# Altium project MB1292.PrjPcb (part 1 of 3)
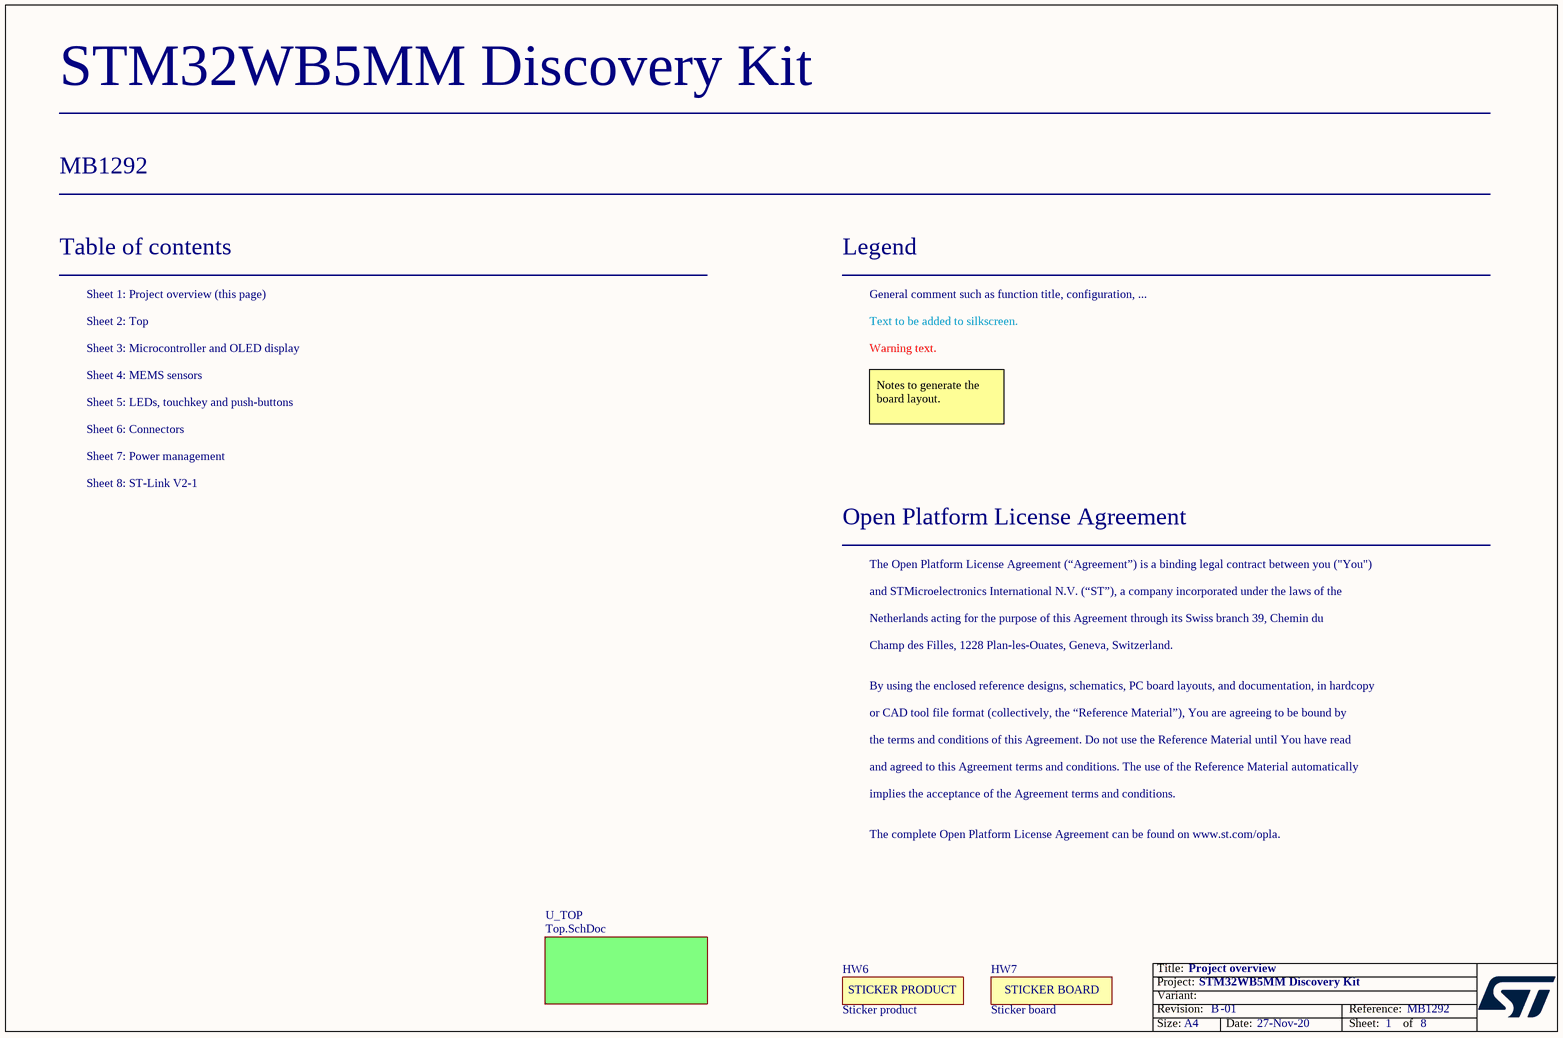
[diagram p0: Project_Overview.SchDoc]
Board_Assembly_Revision: 01; Board_Document_Date: 27-Nov-20; Board_Name: STM32WB5MM Discovery Kit; Board_PCB_Revision: B; Board_Reference: MB1292
8 sheets, 190 parts. Net scope: flat (ports and power ports of the same name join across sheets).
Board file: MB1292.PcbDoc
Sheets:
  Project_Overview.SchDoc
    U_TOP = Top.SchDoc
      U_ST-LINK_V2-1 = ST-LINK_V2-1.SchDoc
      U_Connectors = Connectors.SchDoc
      U_MEMS = MEMS.SchDoc
      U_MCU_Display = MCU_Display.SchDoc
      U_Power_management = Power_management.SchDoc
      U_LEDs_Buttons = LEDs_Buttons.SchDoc

## Sheet Project_Overview.SchDoc: Project overview
size A4; Date: Not used; ApprovedBy: Not used; CheckedBy: Not used; Author: Not used; CompanyName: STMicroelectronics; DrawnBy: Not used; Engineer: Not used; Organization: Not used; Address1: Not used; Address2: Not used; Address3: Not used; Address4: Not used; DocumentNumber: Not used; Revision: Not used; SheetNumber: 1; SheetTotal: 8; CurrentTime: Not used; CurrentDate: Not used; Time: Not used; DocumentFullPathAndName: Not used; DocumentName: Not used; ModifiedDate: Not used; ImagePath: Not used; ProjectName: Not used; Application_BuildNumber: Not used

### Parts
HW6  value Sticker product  [STICKER_PRODUCT_25X9]  (hidden comment: STICKER_PRODUCT)  (no BOM)
HW7  value Sticker board  [STICKER_BOARD_25X9]  (hidden comment: STICKER_BOARD)  (no BOM)

### Sub-sheets
U_TOP = Top.SchDoc: no entries

### Notes on the sheet
- Table of contents
- Sheet 1: Project overview (this page)
- Legend
- General comment such as function title, configuration, ...
- Sheet 2: Top
- Sheet 3: Microcontroller and OLED display
- Sheet 4: MEMS sensors
- Text to be added to silkscreen.
- Warning text.
- Sheet 6: Connectors
- Sheet 5: LEDs, touchkey and push-buttons
- Notes to generate the board layout.
- Sheet 7: Power management
- Sheet 8: ST-Link V2-1
- Open Platform License Agreement
- The Open Platform License Agreement (“Agreement”) is a binding legal contract between you ("You")
- and STMicroelectronics International N.V. (“ST”), a company incorporated under the laws of the
- Netherlands acting for the purpose of this Agreement through its Swiss branch 39, Chemin du
- Champ des Filles, 1228 Plan-les-Ouates, Geneva, Switzerland.
- By using the enclosed reference designs, schematics, PC board layouts, and documentation, in hardcopy
- or CAD tool file format (collectively, the “Reference Material”), You are agreeing to be bound by
- the terms and conditions of this Agreement. Do not use the Reference Material until You have read
- and agreed to this Agreement terms and conditions. The use of the Reference Material automatically
- implies the acceptance of the Agreement terms and conditions.
- The complete Open Platform License Agreement can be found on www.st.com/opla.
- Title:
- Project:
- Size:
- Revision:
- Variant:
- A4
- -
- Date:
- Reference:
- Sheet:
- of
- (in symbol MCD-00235) STICKER BOARD
- (in symbol MCD-00547) STICKER PRODUCT

### Library data of the parts
HW6 = MCD-00547: Sticker product 25x9 mm; Part_Preference: Recommended; Part_Type: Misc; Internal_Part_Number: MCD-00547; Status: Released; Manufacturer: N/A; Manufacturer_Part_Number: N/A; Alternate_Manufacturer: N/A; Alternate_Manufacturer_Part_Number: N/A; Package: N/A; ComponentLink1URL: N/A; Order_Code_Digikey: N/A; Order_Code_Farnell: N/A; Order_Code_RS: N/A
HW7 = MCD-00235: Sticker Board 25x9 mm; Part_Preference: Recommended; Part_Type: Misc; Internal_Part_Number: MCD-00235; Status: Released; Manufacturer: N/A; Manufacturer_Part_Number: N/A; Alternate_Manufacturer: N/A; Alternate_Manufacturer_Part_Number: N/A; Package: N/A; ComponentLink1URL: N/A; Order_Code_Digikey: N/A; Order_Code_Farnell: N/A; Order_Code_RS: N/A

## Sheet Top.SchDoc: Top
size A4; Date: Not used; ApprovedBy: Not used; CheckedBy: Not used; Author: Not used; CompanyName: STMicroelectronics; DrawnBy: Not used; Engineer: Not used; Organization: Not used; Address1: Not used; Address2: Not used; Address3: Not used; Address4: Not used; DocumentNumber: Not used; Revision: Not used; SheetNumber: 2; SheetTotal: 8; CurrentTime: Not used; CurrentDate: Not used; Time: Not used; DocumentFullPathAndName: Not used; DocumentName: Not used; ModifiedDate: Not used; ImagePath: Not used; ProjectName: Not used; Application_BuildNumber: Not used
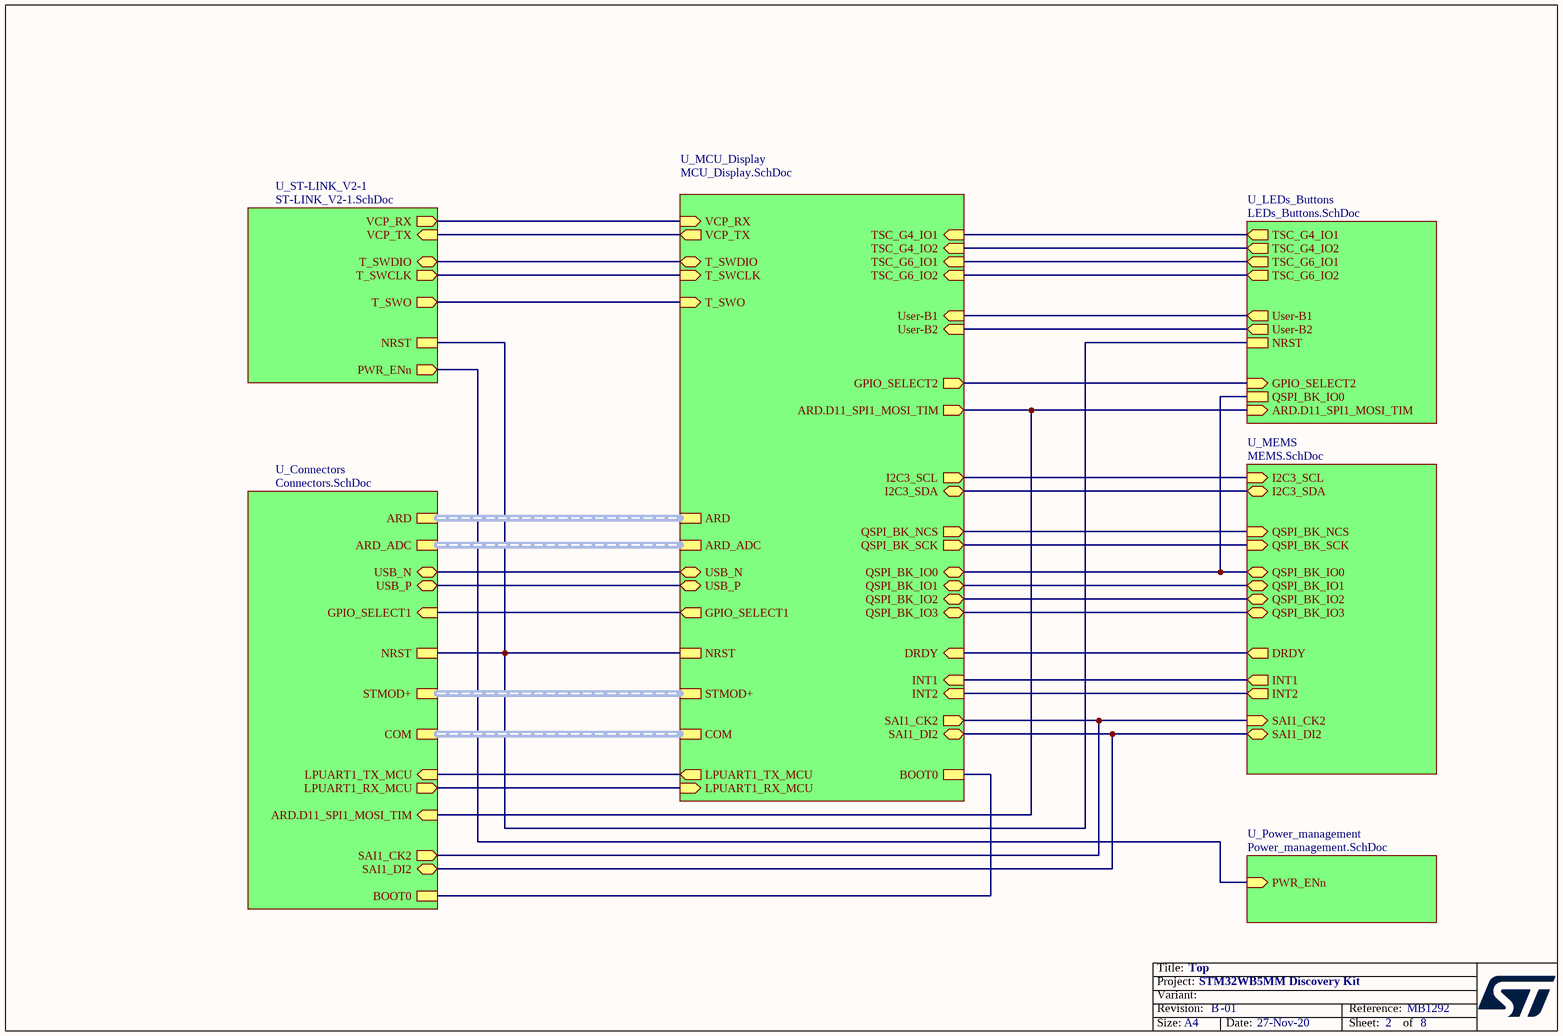
[diagram p1: Top.SchDoc]

### Sub-sheets
U_Connectors = Connectors.SchDoc: ARD (harness ARD), ARD_ADC (harness ARD_ADC), USB_P (bidir), USB_N (bidir), GPIO_SELECT1 (in), NRST, STMOD+ (harness STMOD+), COM (harness COM), LPUART1_TX_MCU (in), LPUART1_RX_MCU (out), ARD.D11_SPI1_MOSI_TIM (in), SAI1_CK2 (out), SAI1_DI2 (bidir), BOOT0
U_LEDs_Buttons = LEDs_Buttons.SchDoc: TSC_G4_IO1 (out), TSC_G4_IO2 (out), TSC_G6_IO1 (out), TSC_G6_IO2 (out), User-B1 (out), User-B2 (out), NRST, GPIO_SELECT2 (in), ARD.D11_SPI1_MOSI_TIM (in), QSPI_BK_IO0
U_MCU_Display = MCU_Display.SchDoc: ARD (harness ARD), ARD_ADC (harness ARD_ADC), USB_P (bidir), USB_N (bidir), GPIO_SELECT1 (out), NRST, TSC_G4_IO1 (in), TSC_G4_IO2 (in), TSC_G6_IO1 (in), TSC_G6_IO2 (in), T_SWDIO (bidir), T_SWCLK (in), T_SWO (in), I2C3_SDA (bidir), I2C3_SCL (out), QSPI_BK_NCS (out), QSPI_BK_SCK (out), QSPI_BK_IO0 (bidir), QSPI_BK_IO1 (bidir), QSPI_BK_IO2 (bidir), QSPI_BK_IO3 (bidir), DRDY (in), INT1 (in), SAI1_CK2 (out), SAI1_DI2 (bidir), User-B1 (in), User-B2 (in), GPIO_SELECT2 (out), STMOD+ (harness STMOD+), ARD.D11_SPI1_MOSI_TIM (out), COM (harness COM), LPUART1_TX_MCU (out), LPUART1_RX_MCU (in), VCP_RX (in), VCP_TX (out), INT2 (in), BOOT0
U_MEMS = MEMS.SchDoc: I2C3_SCL (in), I2C3_SDA (bidir), QSPI_BK_NCS (in), QSPI_BK_SCK (in), QSPI_BK_IO0 (bidir), QSPI_BK_IO1 (bidir), QSPI_BK_IO2 (bidir), QSPI_BK_IO3 (bidir), DRDY (out), INT1 (out), SAI1_CK2 (in), SAI1_DI2 (bidir), INT2 (out)
U_Power_management = Power_management.SchDoc: PWR_ENn (in)
U_ST-LINK_V2-1 = ST-LINK_V2-1.SchDoc: VCP_TX (in), VCP_RX (out), NRST, T_SWDIO (bidir), T_SWCLK (out), T_SWO (out), PWR_ENn (out)

### Nets
(unnamed): sheet U_ST-LINK_V2-1/VCP_TX, sheet U_MCU_Display/VCP_TX
(unnamed): sheet U_ST-LINK_V2-1/VCP_RX, sheet U_MCU_Display/VCP_RX
(unnamed): sheet U_ST-LINK_V2-1/NRST, sheet U_Connectors/NRST, sheet U_MCU_Display/NRST, sheet U_LEDs_Buttons/NRST
(unnamed): sheet U_ST-LINK_V2-1/T_SWDIO, sheet U_MCU_Display/T_SWDIO
(unnamed): sheet U_ST-LINK_V2-1/T_SWCLK, sheet U_MCU_Display/T_SWCLK
(unnamed): sheet U_ST-LINK_V2-1/T_SWO, sheet U_MCU_Display/T_SWO
(unnamed): sheet U_ST-LINK_V2-1/PWR_ENn, sheet U_Power_management/PWR_ENn
(unnamed): sheet U_Connectors/USB_P, sheet U_MCU_Display/USB_P
(unnamed): sheet U_Connectors/USB_N, sheet U_MCU_Display/USB_N
(unnamed): sheet U_Connectors/GPIO_SELECT1, sheet U_MCU_Display/GPIO_SELECT1
(unnamed): sheet U_Connectors/LPUART1_TX_MCU, sheet U_MCU_Display/LPUART1_TX_MCU
(unnamed): sheet U_Connectors/LPUART1_RX_MCU, sheet U_MCU_Display/LPUART1_RX_MCU
(unnamed): sheet U_Connectors/ARD.D11_SPI1_MOSI_TIM, sheet U_MCU_Display/ARD.D11_SPI1_MOSI_TIM, sheet U_LEDs_Buttons/ARD.D11_SPI1_MOSI_TIM
(unnamed): sheet U_Connectors/SAI1_CK2, sheet U_MEMS/SAI1_CK2, sheet U_MCU_Display/SAI1_CK2
(unnamed): sheet U_Connectors/SAI1_DI2, sheet U_MEMS/SAI1_DI2, sheet U_MCU_Display/SAI1_DI2
(unnamed): sheet U_Connectors/BOOT0, sheet U_MCU_Display/BOOT0
(unnamed): sheet U_MEMS/I2C3_SCL, sheet U_MCU_Display/I2C3_SCL
(unnamed): sheet U_MEMS/I2C3_SDA, sheet U_MCU_Display/I2C3_SDA
(unnamed): sheet U_MEMS/QSPI_BK_NCS, sheet U_MCU_Display/QSPI_BK_NCS
(unnamed): sheet U_MEMS/QSPI_BK_SCK, sheet U_MCU_Display/QSPI_BK_SCK
(unnamed): sheet U_MEMS/QSPI_BK_IO0, sheet U_MCU_Display/QSPI_BK_IO0, sheet U_LEDs_Buttons/QSPI_BK_IO0
(unnamed): sheet U_MEMS/QSPI_BK_IO1, sheet U_MCU_Display/QSPI_BK_IO1
(unnamed): sheet U_MEMS/QSPI_BK_IO2, sheet U_MCU_Display/QSPI_BK_IO2
(unnamed): sheet U_MEMS/QSPI_BK_IO3, sheet U_MCU_Display/QSPI_BK_IO3
(unnamed): sheet U_MEMS/DRDY, sheet U_MCU_Display/DRDY
(unnamed): sheet U_MEMS/INT1, sheet U_MCU_Display/INT1
(unnamed): sheet U_MEMS/INT2, sheet U_MCU_Display/INT2
(unnamed): sheet U_MCU_Display/TSC_G4_IO1, sheet U_LEDs_Buttons/TSC_G4_IO1
(unnamed): sheet U_MCU_Display/TSC_G4_IO2, sheet U_LEDs_Buttons/TSC_G4_IO2
(unnamed): sheet U_MCU_Display/TSC_G6_IO1, sheet U_LEDs_Buttons/TSC_G6_IO1
(unnamed): sheet U_MCU_Display/TSC_G6_IO2, sheet U_LEDs_Buttons/TSC_G6_IO2
(unnamed): sheet U_MCU_Display/User-B1, sheet U_LEDs_Buttons/User-B1
(unnamed): sheet U_MCU_Display/User-B2, sheet U_LEDs_Buttons/User-B2
(unnamed): sheet U_MCU_Display/GPIO_SELECT2, sheet U_LEDs_Buttons/GPIO_SELECT2

### Buses and harness runs
harness sheet U_Connectors/ARD = sheet U_MCU_Display/ARD
harness sheet U_Connectors/ARD_ADC = sheet U_MCU_Display/ARD_ADC
harness sheet U_Connectors/COM = sheet U_MCU_Display/COM
harness sheet U_Connectors/STMOD+ = sheet U_MCU_Display/STMOD+

### Notes on the sheet
- Title:
- Project:
- Size:
- Revision:
- Variant:
- A4
- -
- Date:
- Reference:
- Sheet:
- of

## Sheet ST-LINK_V2-1.SchDoc: ST-LINK V2-1
size A4; Date: Not used; ApprovedBy: Not used; CheckedBy: Not used; Author: Not used; CompanyName: STMicroelectronics; DrawnBy: Not used; Engineer: Not used; Organization: Not used; Address1: Not used; Address2: Not used; Address3: Not used; Address4: Not used; DocumentNumber: Not used; Revision: Not used; SheetNumber: 8; SheetTotal: 8; CurrentTime: Not used; CurrentDate: Not used; Time: Not used; DocumentFullPathAndName: Not used; DocumentName: Not used; ModifiedDate: Not used; ImagePath: Not used; ProjectName: Not used; Application_BuildNumber: Not used
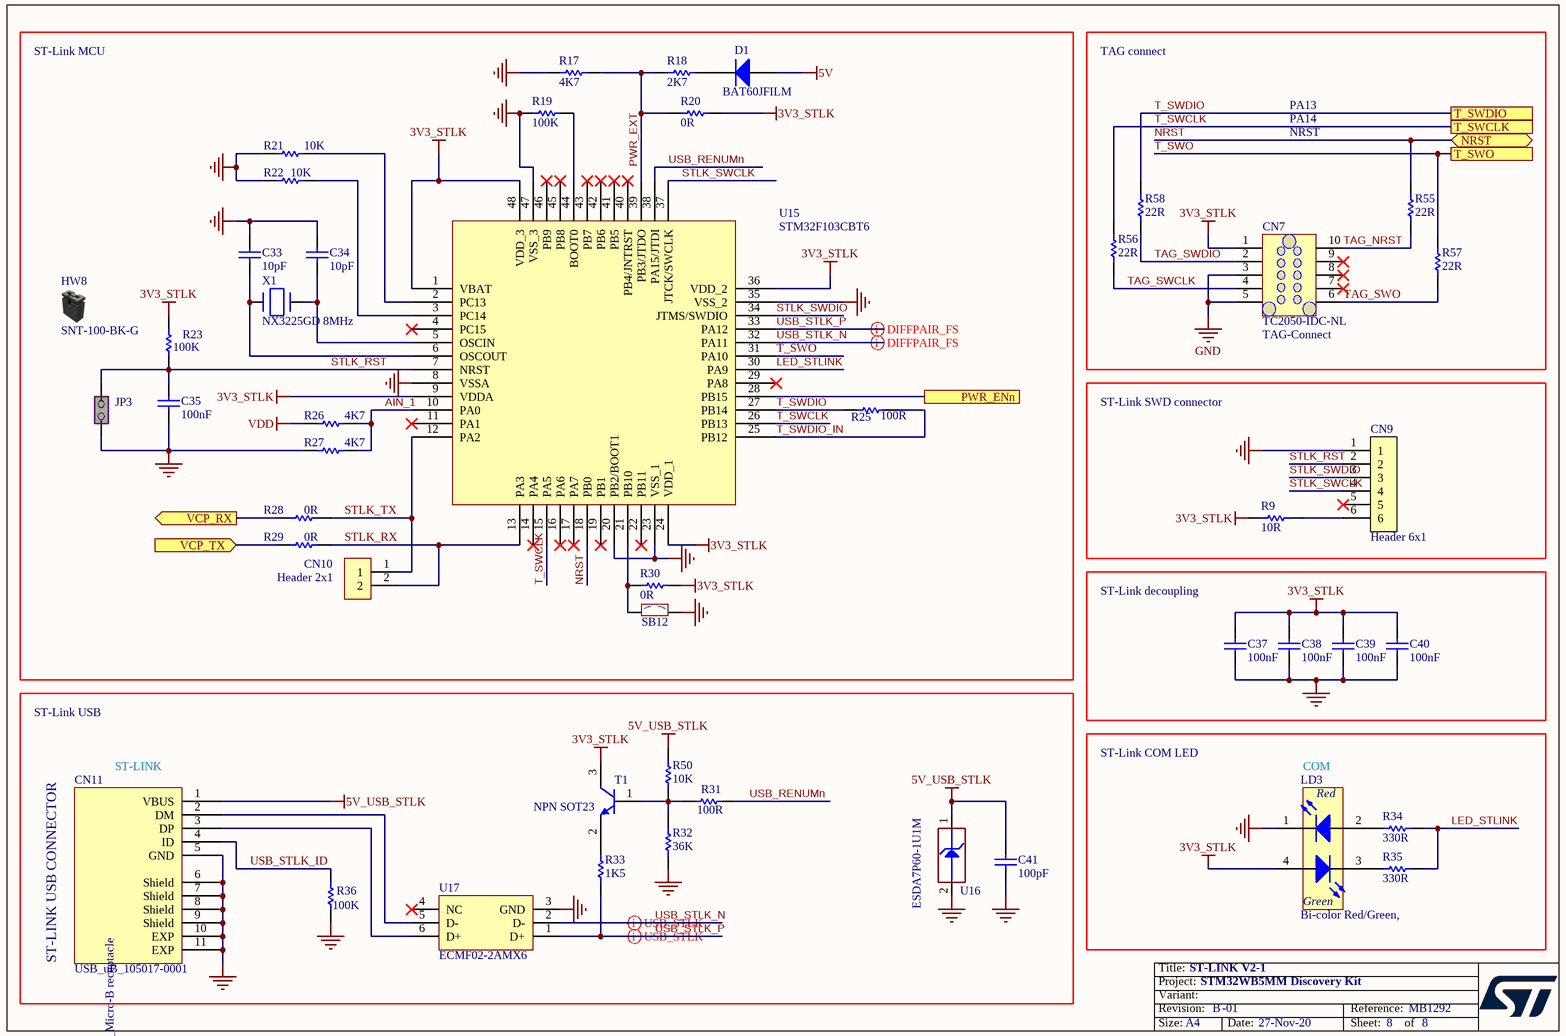
[diagram p2: ST-LINK_V2-1.SchDoc]

### Parts
C33  value 10pF  [C0402]  (hidden comment: Capacitor)
C34  value 10pF  [C0402]  (hidden comment: Capacitor)
C35  value 100nF  [C0402]  (hidden comment: Capacitor)
C37  value 100nF  [C0402]  (hidden comment: Capacitor)
C38  value 100nF  [C0402]  (hidden comment: Capacitor)
C39  value 100nF  [C0402]  (hidden comment: Capacitor)
C40  value 100nF  [C0402]  (hidden comment: Capacitor)
C41  value 100pF  [C0603_H0P8]  (hidden comment: Capacitor)
CN7  value TC2050-IDC-NL  [CON_TAG-C_TC2050-IDC-NL]  (hidden comment: Tag-10-C)
CN9  Header 6x1  [CON_SAMTEC_TSW-106-14-G-S]
CN10  Header 2x1  [CON_SAMTEC_TSW-102-07-G-S]
CN11  value USB_uB_105017-0001  [CON_USBMICROB_MOLEX_105017-0001_H2P90]  (hidden comment: USB_uB_105017.0001)
D1  BAT60JFILM  [DIO_SOD323]
HW8  value SNT-100-BK-G  (hidden comment: Shunt Black 2.54mm)  (mechanical)
JP3  Jumper_Header 2x1 Fitted  [CON_SAMTEC_TSW-102-07-G-S]  (value not drawn)
LD3  value Bi-color Red/Green,  [LED_BI-GR_HSMF-A201-A00J1]  (hidden comment: LD_BICOLOR_CMS)
R9  value 10R  [R0402]  (hidden comment: Resistor)
R17  value 4K7  [R0402]  (hidden comment: Resistor)
R18  value 2K7  [R0402]  (hidden comment: Resistor)
R19  value 100K  [R0402]  (hidden comment: Resistor)
R20  value 0R  [R0402]  (hidden comment: Resistor)
R21  value 10K  [R0402]  (hidden comment: Resistor)
R22  value 10K  [R0402]  (hidden comment: Resistor)
R23  value 100K  [R0402]  (hidden comment: Resistor)
R25  value 100R  [R0402]  (hidden comment: Resistor)
R26  value 4K7  [R0402]  (hidden comment: Resistor)
R27  value 4K7  [R0402]  (hidden comment: Resistor)
R28  value 0R  [R0402]  (hidden comment: Resistor)
R29  value 0R  [R0402]  (hidden comment: Resistor)
R30  value 0R  [R0402]  (hidden comment: Resistor)
R31  value 100R  [R0402]  (hidden comment: Resistor)
R32  value 36K  [R0402]  (hidden comment: Resistor)
R33  value 1K5  [R0402]  (hidden comment: Resistor)
R34  value 330R  [R0402]  (hidden comment: Resistor)
R35  value 330R  [R0402]  (hidden comment: Resistor)
R36  value 100K  [R0402]  (hidden comment: Resistor)
R50  value 10K  [R0402]  (hidden comment: Resistor)
R55  value 22R  [R0402]  (hidden comment: Resistor)
R56  value 22R  [R0402]  (hidden comment: Resistor)
R57  value 22R  [R0402]  (hidden comment: Resistor)
R58  value 22R  [R0402]  (hidden comment: Resistor)
SB12  SB_OFF  [SOLDER-BRIDGE_R0603-0R]  (value not drawn)
T1  value NPN SOT23  [NPN_SOT23]  (hidden comment: 9013-SOT23)
U15  STM32F103CBT6  [ICC_LQFP48_7X7_P050]
U16  value ESDA7P60-1U1M  [ESD_QFN2_1P6X1_P125]  (hidden comment: ESD-TRANSIL)
U17  ECMF02-2AMX6  [ESD_QFN-6L_1P7X1P5_P050]
X1  value NX3225GD 8MHz  [CRY_NX3225GD_2P]  (hidden comment: XTAL_2_PINS)

### Blocks framed on the sheet
ST-Link MCU: C33-C35 CN10 D1 HW8 JP3 R17-R23 R25-R30 SB12 U15 X1
ST-Link SWD connector: CN9 R9
ST-Link decoupling: C37-C40
ST-LINK USB CONNECTOR: C41 CN11 R31-R33 R36 R50 T1 U16 U17

### Ports
NRST (bidir), PWR_ENn, T_SWCLK, T_SWDIO, T_SWO, VCP_RX (out), VCP_TX (in)

### Nets
3V3_STLK: C37.2 C38.2 C39.2 C40.2 CN7.1 LD3.4(YellowGreen_anode) R9.1 R20.2 R23.2 R30.2 T1.3(C) U15.1(VBAT) U15.9(VDDA) U15.24(VDD_1) U15.36(VDD_2) U15.48(VDD_3)
5V: D1.1(A)
5V_USB_STLK: C41.1 CN11.1(VBUS) R50.2 U16.1(IO1)
GND: C33.2 C34.2 C35.1 C37.1 C38.1 C39.1 C40.1 C41.2 CN7.3 CN7.5 CN9.1 CN11.5(GND) CN11.6(Shield) CN11.7(Shield) CN11.8(Shield) CN11.9(Shield) CN11.10(EXP) CN11.11(EXP) JP3.2(NO) LD3.1(RED_cathode) R17.1 R19.1 R21.2 R22.1 R27.1 R32.1 R36.1 SB12.2 U15.8(VSSA) U15.20(PB2/BOOT1) U15.23(VSS_1) U15.35(VSS_2) U15.47(VSS_3) U16.2(GND) U17.3(GND)
VDD: R26.1
AIN_1: R26.2 R27.2 U15.10(PA0)
LED_STLINK: R34.2 R35.2 U15.30(PA9)
NRST: R55.2 U15.18(PB0) ; port NRST
PWR_ENn: U15.28(PB15) ; port PWR_ENn
PWR_EXT: R17.2 R18.1 R20.1 U15.39(PB3/JTDO)
STLK_RST: C35.2 CN9.2 JP3.1(COMMON) R23.1 U15.7(NRST)
STLK_RX: CN10.2 R29.2 U15.13(PA3)
STLK_SWCLK: CN9.4 U15.37(JTCK/SWCLK)
STLK_SWDIO: CN9.3 U15.34(JTMS/SWDIO)
STLK_TX: CN10.1 R28.1 U15.12(PA2)
T_SWCLK: R56.2 U15.15(PA5) U15.26(PB13) ; port T_SWCLK
T_SWDIO: R25.1 R58.2 U15.27(PB14) ; port T_SWDIO
T_SWDIO_IN: R25.2 U15.25(PB12)
T_SWO: R57.1 U15.31(PA10) ; port T_SWO
TAG_NRST: CN7.10 R55.1
TAG_SWCLK: CN7.4 R56.1
TAG_SWDIO: CN7.2 R58.1
TAG_SWO: CN7.6 R57.2
USB_RENUMn: R31.2 U15.38(PA15/JTDI)
USB_STLK_ID: CN11.4(ID) R36.2
USB_STLK_N: U15.32(PA11) U17.2(D-)
USB_STLK_P: R33.1 U15.33(PA12) U17.1(D+)
VCP_RX: R28.2 ; port VCP_RX
VCP_TX: R29.1 ; port VCP_TX
NetC33_1: C33.1 U15.6(OSCOUT) X1.2(X2)
NetC34_1: C34.1 U15.5(OSCIN) X1.1(X1)
NetCN9_6: CN9.6 R9.2
NetCN11_2: CN11.2(DM) U17.5(D-)
NetCN11_3: CN11.3(DP) U17.6(D+)
NetD1_2: D1.2(K) R18.2
NetLD3_2: LD3.2(Red_anode) R34.1
NetLD3_3: LD3.3(YellowGreen_cathode) R35.1
NetR19_2: R19.2 U15.44(BOOT0)
NetR21_1: R21.1 U15.2(PC13)
NetR22_2: R22.2 U15.3(PC14)
NetR30_1: R30.1 SB12.1 U15.21(PB10)
NetR31_1: R31.1 R32.2 R50.1 T1.1(B)
NetR33_2: R33.2 T1.2(E)

Not connected (* = marked no-connect by the designer): CN7 7* 8* 9*; CN9 5*; U15 4(PC15)* 11(PA1)* 14(PA4)* 16(PA6)* 17(PA7)* 19(PB1)* 22(PB11)* 29(PA8)* 40(PB4/JNTRST)* 41(PB5)* 42(PB6)* 43(PB7)* 45(PB8)* 46(PB9)*; U17 4(NC)*

### Layout directives
differential pair: USB_STLK_N, USB_STLK_P

### Notes on the sheet
- TAG connect
- PA13
- PA14
- NRST
- (near CN7) TAG-Connect
- ST-Link USB
- (near CN11) ST-LINK
- ST-Link COM LED
- COM
- Title:
- Project:
- Size:
- Revision:
- Variant:
- A4
- -
- Date:
- Reference:
- Sheet:
- of
- (in symbol MCD-00028) USB_Micro-B receptacle
- (in symbol MCD-02360) Red; Green

### Library data of the parts
C33 C34 = MCD-00015: Capacitor, MLCC, 10pF, 50V, NPO, +/-5%, 0402, T=0,5mm; Manufacturer_Part_Number: CC0402JRNPO9BN100; Manufacturer: YAGEO; Part_Preference: Recommended; Internal_Part_Number: MCD-00015; Status: Released; Part_Type: Capacitor; Package: C0402; ComponentLink1URL: http://tunmcdsvn.tun.st.com/Component_Datasheet_Library/Trunk/Capacitors/Yageo_Capacitor_NP0_16V-to-50V
C35 C37-C40 = MCD-00006: Capacitor, MLCC, 100nF, 16V, X7R, +/-10%, 0402, T=0.5mm; Manufacturer_Part_Number: CC0402KRX7R7BB104; Manufacturer: YAGEO; Alternate_Manufacturer_Part_Number: GCM155R71C104KA55D; Alternate_Manufacturer: MURATA; Part_Preference: Recommended; Order_Code_RS: 616-9701; Internal_Part_Number: MCD-00006; Status: Released; Part_Type: Capacitor; Package: C0402; ComponentLink1URL: http://tunmcdsvn.tun.st.com/Component_Datasheet_Library/Trunk/Capacitors/Yageo_Multilayer_Capacitor_X7R_series_100pF_to_22uF; Order_Code_Digikey: 311-1338-1-ND; Order_Code_Farnell: 9402047
C41 = MCD-01648: Capacitor,MLCC,100pF 50V,NPO,+/-5%, 0603,T=0,8mm; Manufacturer_Part_Number: CC0603JRNPO9BN101; Manufacturer: YAGEO; Part_Preference: Recommended; Order_Code_RS: 625-0267; Internal_Part_Number: MCD-01648; Status: Released; Part_Type: Capacitor; Package: C0603; ComponentLink1URL: http://tunmcdsvn.tun.st.com/Component_Datasheet_Library/Trunk/Capacitors/Yageo_UPY-GP_NP0_16V-to-50V/YAGEO_NP0_UPY-GP_NP0_16V-to-50V_16.pdf; Order_Code_Digikey: 311-1069-1-ND; Order_Code_Farnell: 722080
CN7 = MCD-00031: Tag_Connector Header, 10x2, No legs; Manufacturer_Part_Number: TC2050-IDC-NL-FP; Manufacturer: TAG-CONNECT LLC; Part_Preference: Recommended; Internal_Part_Number: MCD-00031; Status: Released; Part_Type: Connector; ComponentLink1URL: http://tunmcdsvn.tun.st.com/Component_Datasheet_Library/Trunk/Connectors/TAG_Connector_TC2050-IDC-NLFP
CN9 = MCD-01592: Header 6x1, 2,54mm, height 10.67mm; Part_Type: Connector; Manufacturer_Part_Number: TSW-106-14-G-S; Manufacturer: SAMTEC; Part_Preference: Recommended; Order_Code_RS: 180-1121; Internal_Part_Number: MCD-01592; Value: Header 6x1; Status: Checked; ComponentLink1URL: http://tunmcdsvn.tun.st.com/Component_Datasheet_Library/Trunk/Connectors/Samtec_TSW-HTSW-series/Samtec_TSW-HTSW-series.pdf; Alternate_Manufacturer: N/A; Alternate_Manufacturer_Part_Number: N/A; Order_Code_Digikey: SAM1053-06-ND; Order_Code_Farnell: 2037181
CN10 = MCD-00032: Header, 2x1, 2,54mm, VR, TH, Height 5.84mm/2.54mm; Manufacturer_Part_Number: TSW-102-07-G-S; Manufacturer: SAMTEC; Part_Type: Connector; Alternate_Manufacturer_Part_Number: 313102S111116; Alternate_Manufacturer: JIUBABA; Part_Preference: Recommended; Value: Header 2x1; Internal_Part_Number: MCD-00032; Status: Released; ComponentLink1URL: http://tunmcdsvn.tun.st.com/Component_Datasheet_Library/Trunk/Connectors/Samtec_TSW-HTSW-series
CN11 = MCD-00028: USB-MICRO-B, 0.65mm, RA, SMT, Bottom Mount,; Manufacturer_Part_Number: 1050170001; Manufacturer: MOLEX; Part_Type: Connector; Part_Preference: Recommended; Internal_Part_Number: MCD-00028; Status: Released; ComponentLink1URL: http://tunmcdsvn.tun.st.com/Component_Datasheet_Library/Trunk/Connectors/Molex_Connector-USB-microB_105017-0001
D1 = MCD-00034: Manufacturer: STMICROELECTRONICS; Part_Type: Diode; BMS_Part_Number: 9151097; Part_Preference: Recommended; Manufacturer_HQ_COO: EU; Internal_Part_Number: MCD-00034; Value: BAT60JFILM; Manufacturer_Part_Number: BAT60JFILM; Status: Released; ComponentLink1URL: http://tunmcdsvn.tun.st.com/Component_Datasheet_Library/Trunk/Diodes/STM_Diode_BAT60JFILM-SOD323
HW8 = MCD-00043: SHUNT 2.54mm BLACK; Part_Type: Misc; Manufacturer: SAMTEC; Alternate_Manufacturer_Part_Number: 316102S111A; Alternate_Manufacturer: JIUBABA; Part_Preference: Recommended; Internal_Part_Number: MCD-00043; Status: Released; Manufacturer_Part_Number: SNT-100-BK-G; ComponentLink1URL: http://tunmcdsvn.tun.st.com/Component_Datasheet_Library/Trunk/Connectors/Samtec_Shunt_Jumper_SNT100
JP3 = MCD-01904: Header, 2x1, 2,54mm, VR, TH, Height 5.84mm/2.54mm - Shunt Fitted by default; Part_Type: Connector; Manufacturer_Part_Number: TSW-102-07-G-S; Manufacturer: SAMTEC; Part_Preference: Recommended; Order_Code_RS: 155-7981; Internal_Part_Number: MCD-01904; Value: Header 2x1; Status: Checked; ComponentLink1URL: http://tunmcdsvn.tun.st.com/Component_Datasheet_Library/Trunk/Connectors/Samtec_TSW-HTSW-series; Alternate_Manufacturer: N/A; Alternate_Manufacturer_Part_Number: N/A; Order_Code_Digikey: SAM1029-02-ND; Order_Code_Farnell: 2505044
LD3 = MCD-02360: Led, Bi-color Red/Green, 2V4, 30mA, 4-PLCC; Part_Type: Display; Part_Preference: Recommended; Manufacturer: EVERLIGHT; Manufacturer_Part_Number: 67-22VRVGC/TR8; Internal_Part_Number: MCD-02360; Status: Checked; Alternate_Manufacturer: N/A; Alternate_Manufacturer_Part_Number: N/A; Package: 4-PLCC; ComponentLink1URL: http://tunmcdsvn.tun.st.com/Component_Documentation_Library/Trunk/Display/EVERLIGHT_67-22VRVGCTR8; Order_Code_Digikey: N/A; Order_Code_Farnell: N/A; Order_Code_RS: N/A
R9 = MCD-00358: Resistor,10R,0402,1%,1/16W; Manufacturer_Part_Number: RC0402FR-0710RL; Manufacturer: YAGEO; Part_Preference: Recommended; Order_Code_RS: 618-5848; Internal_Part_Number: MCD-00358; Status: Released; Part_Type: Resistor; Package: R0402; ComponentLink1URL: http://tunmcdsvn.tun.st.com/Component_Datasheet_Library/Trunk/Resistors/Yageo_Resistor_RC0402-series; Order_Code_Digikey: 311-10.0LRCT-ND; Order_Code_Farnell: 9238999
R17 R26 R27 = MCD-00065: Resistor,4K7,0402,1%,1/16W; Manufacturer_Part_Number: RC0402FR-074K7L; Manufacturer: YAGEO; Alternate_Manufacturer_Part_Number: RT0402FRE074K7L; Part_Preference: Recommended; Internal_Part_Number: MCD-00065; Alternate_Manufacturer: YAGEO; Status: Released; Part_Type: Resistor; ComponentLink1URL: http://tunmcdsvn.tun.st.com/Component_Datasheet_Library/Trunk/Resistors/Yageo_Resistor_RC0402-series; Package: R0402; Order_Code_Digikey: 311-4.7KLRCT-ND; Order_Code_Farnell: 9239316; Order_Code_RS: N/A
R18 = MCD-00055: Resistor,2K7,0402,1%,1/16W; Manufacturer_Part_Number: RC0402FR-072K7L; Manufacturer: YAGEO; Part_Preference: Recommended; Internal_Part_Number: MCD-00055; Status: Released; Part_Type: Resistor; ComponentLink1URL: http://tunmcdsvn.tun.st.com/Component_Datasheet_Library/Trunk/Resistors/Yageo_Resistor_RC0402-series; Package: R0402; Order_Code_Digikey: 311-2.70KLRCT-ND; Order_Code_Farnell: 9239286; Order_Code_RS: N/A
R19 R23 R36 = MCD-00059: Resistor,100K,0402,1%,1/16W; Manufacturer_Part_Number: RC0402FR-07100KL; Manufacturer: YAGEO; Alternate_Manufacturer_Part_Number: RT0402FRE07100KL; Part_Preference: Recommended; Internal_Part_Number: MCD-00059; Alternate_Manufacturer: YAGEO; Status: Released; Part_Type: Resistor; ComponentLink1URL: http://tunmcdsvn.tun.st.com/Component_Datasheet_Library/Trunk/Resistors/Yageo_Resistor_RC0402-series; Package: R0402; Order_Code_Digikey: 311-100KLRTR-ND; Order_Code_Farnell: 2421891; Order_Code_RS: N/A
R20 R28-R30 = MCD-00052: Resistor,0R,0402,5%,1/16W; Manufacturer_Part_Number: RC0402JR-070RL; Manufacturer: YAGEO; Part_Preference: Recommended; Order_Code_RS: 618-5804; Internal_Part_Number: MCD-00052; Status: Released; Part_Type: Resistor; ComponentLink1URL: http://tunmcdsvn.tun.st.com/Component_Datasheet_Library/Trunk/Resistors/Yageo_Resistor_RC0402-series; Package: R0402; Order_Code_Digikey: 311-0.0JRCT-ND; Order_Code_Farnell: 9232516RL
R21 R22 R50 = MCD-00053: Resistor,10K,0402,1%,1/16W; Manufacturer_Part_Number: RC0402FR-0710KL; Manufacturer: YAGEO; BMS_Part_Number: 9131590; Part_Preference: Recommended; Internal_Part_Number: MCD-00053; Status: Released; Part_Type: Resistor; ComponentLink1URL: http://tunmcdsvn.tun.st.com/Component_Datasheet_Library/Trunk/Resistors/Yageo_Resistor_RC0402-series; Package: R0402; Order_Code_Digikey: 311-10.0KLRCT-ND; Order_Code_Farnell: 9239359; Order_Code_RS: N/A
R25 R31 = MCD-00067: Resistor,100R,0402,1%,1/16W; Manufacturer_Part_Number: RC0402FR-07100RL; Manufacturer: YAGEO; Part_Preference: Recommended; Internal_Part_Number: MCD-00067; Status: Released; Part_Type: Resistor; ComponentLink1URL: http://tunmcdsvn.tun.st.com/Component_Datasheet_Library/Trunk/Resistors/Yageo_Resistor_RC0402-series; Package: R0402; Order_Code_Digikey: 311-100LRCT-ND; Order_Code_Farnell: 9239111; Order_Code_RS: N/A
R32 = MCD-00069: Resistor,36K,0402,1%,1/16W; Manufacturer_Part_Number: RC0402FR-0736KL; Manufacturer: YAGEO; Part_Preference: Recommended; Internal_Part_Number: MCD-00069; Status: Released; Part_Type: Resistor; ComponentLink1URL: http://tunmcdsvn.tun.st.com/Component_Datasheet_Library/Trunk/Resistors/Yageo_Resistor_RC0402-series; Package: R0402; Order_Code_Digikey: 311-36.0KLRCT-ND; Order_Code_Farnell: 1458788; Order_Code_RS: N/A
R33 = MCD-00068: Resistor,1K5,0402,1%,1/16W; Manufacturer_Part_Number: RC0402FR-071K5L; Manufacturer: YAGEO; Part_Preference: Recommended; Internal_Part_Number: MCD-00068; Status: Released; Part_Type: Resistor; ComponentLink1URL: http://tunmcdsvn.tun.st.com/Component_Datasheet_Library/Trunk/Resistors/Yageo_Resistor_RC0402-series; Package: R0402; Order_Code_Digikey: 311-1.50KLRCT-ND; Order_Code_Farnell: 9239251; Order_Code_RS: N/A
R34 R35 = MCD-00062: Resistor,330R,0402,1%,1/16W; Manufacturer_Part_Number: RC0402FR-07330RL; Manufacturer: YAGEO; Part_Preference: Recommended; Internal_Part_Number: MCD-00062; Status: Released; Part_Type: Resistor; ComponentLink1URL: http://tunmcdsvn.tun.st.com/Component_Datasheet_Library/Trunk/Resistors/Yageo_Resistor_RC0402-series; Package: R0402; Order_Code_Digikey: 311-330LRCT-ND; Order_Code_Farnell: 9239170; Order_Code_RS: N/A
R55-R58 = MCD-00189: Resistor,22R,0402,1%,1/16W; Manufacturer_Part_Number: RC0402FR-0722RL; Manufacturer: YAGEO; Part_Preference: Recommended; Internal_Part_Number: MCD-00189; Status: Released; Part_Type: Resistor; Package: R0402; ComponentLink1URL: http://tunmcdsvn.tun.st.com/Component_Datasheet_Library/Trunk/Resistors/Yageo_Resistor_RC0402-series; Order_Code_Digikey: 311-22.0LRCT-ND; Order_Code_Farnell: 9239030; Order_Code_RS: N/A
SB12 = MCD-00072: Solder Bridge OFF; Part_Type: Misc; Manufacturer_Part_Number: RC0603JR-070RL; Manufacturer: YAGEO; Part_Preference: Recommended; Internal_Part_Number: MCD-00072; Status: Released; Package: SB0603; ComponentLink1URL: http://tunmcdsvn.tun.st.com/Component_Datasheet_Library/Trunk/Resistors/Yageo_Resistor_RC0603-series
T1 = MCD-00073: NPN Bipolar Transistor; Manufacturer_Part_Number: BSR14; Manufacturer: ON SEMICONDUCTOR; Part_Type: IC; Alternate_Manufacturer_Part_Number: MMBT2222LT1G / MMBT2222ALT1G / MMBT2222ALT3G; Part_Preference: Recommended; Revision: *; Internal_Part_Number: MCD-00073; Status: Released; ComponentLink1URL: http://tunmcdsvn.tun.st.com/Component_Datasheet_Library/Trunk/IC/NXP_Transistor_BSR14; Alternate_Manufacturer: ON SEMICONDUCTOR; Package: SOT23
U15 = MCD-00085: Medium-density performance line ARM-based 32-bit MCU with 128KB Flash; Manufacturer: STMICROELECTRONICS; Part_Type: IC; BMS_Part_Number: 9175111; Part_Preference: Recommended; Manufacturer_HQ_COO: EU; Value: STM32F103CBT6; Internal_Part_Number: MCD-00085; Manufacturer_Part_Number: STM32F103CBT6; Status: Released; ComponentLink1URL: http://tunmcdsvn.tun.st.com/Component_Datasheet_Library/Trunk/IC/STM_STM32F103CBT6
U16 = MCD-00251: High power transient voltage suppressor, 7V breakdown; Part_Type: Diode; Manufacturer: STMICROELECTRONICS; BMS_Part_Number: 9179042; Part_Preference: Recommended; Manufacturer_HQ_COO: EU; Internal_Part_Number: MCD-00251; Status: Released; Manufacturer_Part_Number: ESDA7P60-1U1M; ComponentLink1URL: http://tunmcdsvn.tun.st.com/Component_Datasheet_Library/Trunk/Diodes/STM_ESD_ESDA7P60-1U1M
U17 = MCD-00649: Common mode filter with ESD protection for USB 2.0 interface; Part_Type: Diode; Manufacturer: STMICROELECTRONICS; BMS_Part_Number: 9151138; Part_Preference: Recommended; Manufacturer_HQ_COO: EU; Internal_Part_Number: MCD-00649; Value: ECMF02-2AMX6; Status: Released; Manufacturer_Part_Number: ECMF02-2AMX6; ComponentLink1URL: http://tunmcdsvn.tun.st.com/Component_Datasheet_Library/Trunk/Diodes/STM_ESD_ECMF02-2AMX6
X1 = MCD-00092: Crystal 8MHz, 8pF, +-20ppm, 500ohms max,  SMD; Manufacturer_Part_Number: NX3225GD 8MHz EXS00A-CG04874; Manufacturer: NDK; Part_Type: Crystal oscillator; BMS_Part_Number: 9157029; Part_Preference: Recommended; Internal_Part_Number: MCD-00092; Status: Released; ComponentLink1URL: http://tunmcdsvn.tun.st.com/Component_Datasheet_Library/Trunk/Crystal_Osc/NDK_Crystal-For-ST_NX3225GD 8MHz EXS00A-CG04874 (EXS10B-20725); Order_Code_Digikey: 644-1391

## Sheet Connectors.SchDoc: Connectors
size A4; Date: Not used; ApprovedBy: Not used; CheckedBy: Not used; Author: Not used; CompanyName: STMicroelectronics; DrawnBy: Not used; Engineer: Not used; Organization: Not used; Address1: Not used; Address2: Not used; Address3: Not used; Address4: Not used; DocumentNumber: Not used; Revision: Not used; SheetNumber: 6; SheetTotal: 8; CurrentTime: Not used; CurrentDate: Not used; Time: Not used; DocumentFullPathAndName: Not used; DocumentName: Not used; ModifiedDate: Not used; ImagePath: Not used; ProjectName: Not used; Application_BuildNumber: Not used
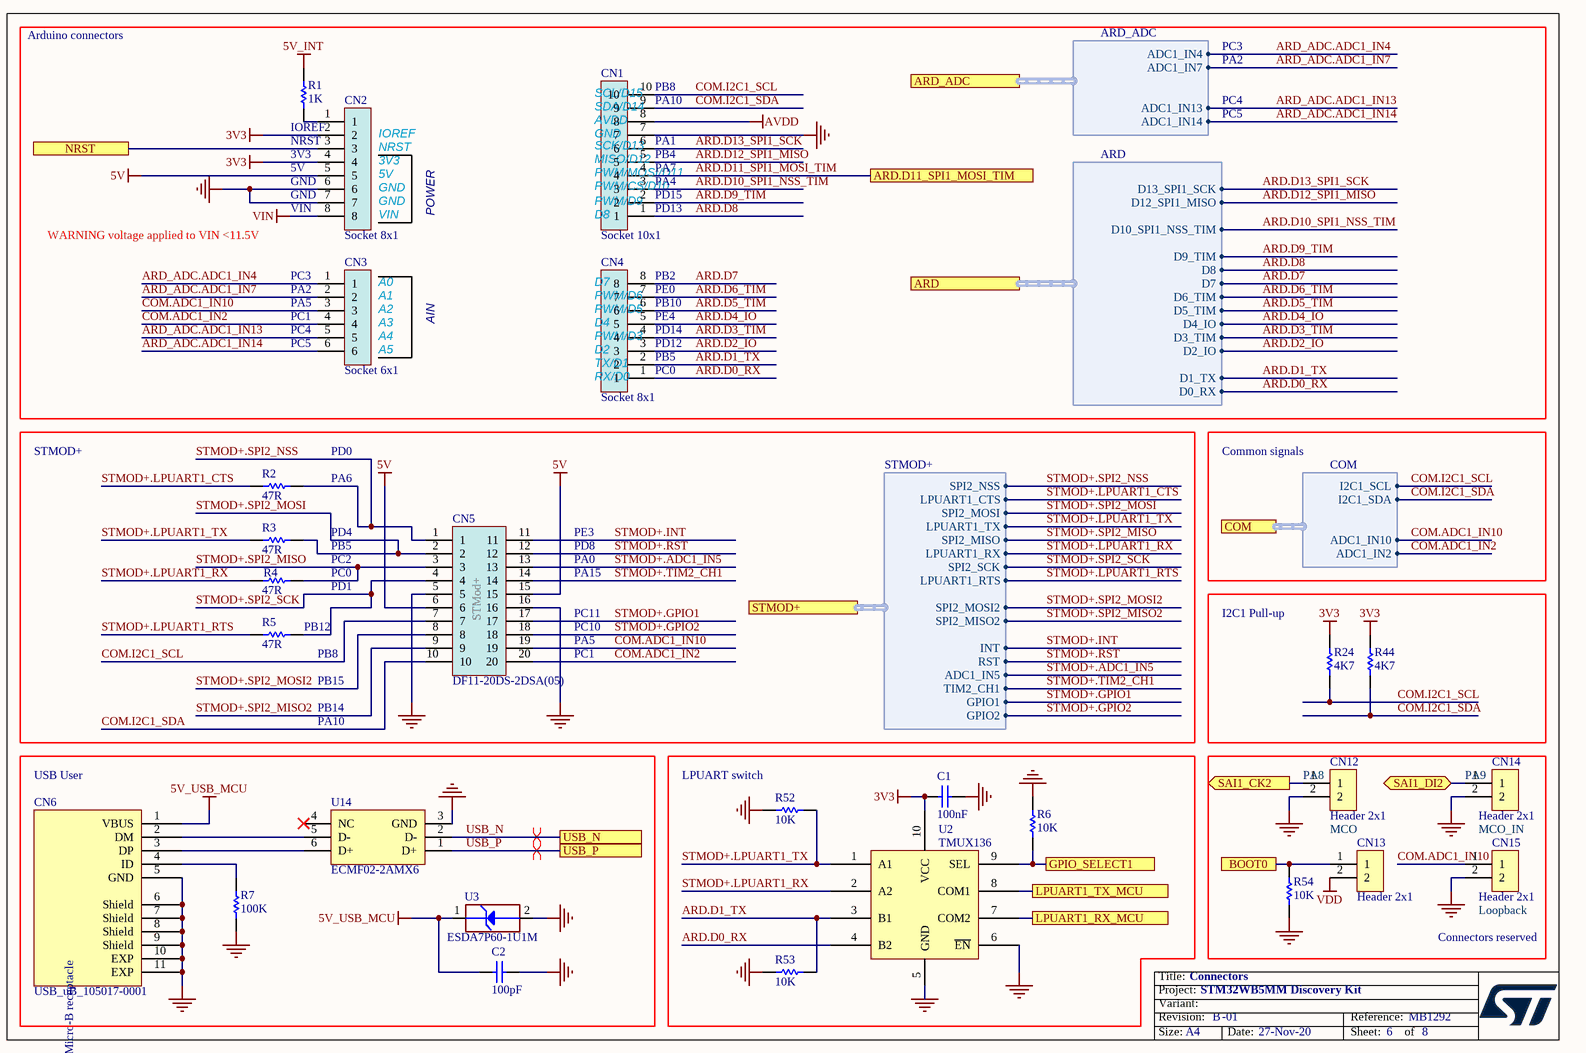
[diagram p3: Connectors.SchDoc]

### Parts
C1  value 100nF  [C0603]  (hidden comment: Capacitor)
C2  value 100pF  [C0603_H0P8]  (hidden comment: Capacitor)
CN1  Socket 10x1  [CON_SAMTEC_SSW-110-22-X-S-VS]
CN2  Socket 8x1  [CON_SAMTEC_SSW-108-22-X-S-VS]
CN3  Socket 6x1  [CON_SAMTEC_SSW-106-22-X-S-VS]
CN4  Socket 8x1  [CON_SAMTEC_SSW-108-22-X-S-VS]
CN5  value DF11-20DS-2DSA(05)  [CON_HRS_DF11-20DS-2DSA-XX_SMT-PCB-SIDE__STMOD+]  (hidden comment: Socket 10X2 STMod+)
CN6  value USB_uB_105017-0001  [CON_USBMICROB_MOLEX_105017-0001_H2P90]  (hidden comment: USB_uB_105017.0001)
CN12  Header 2x1  [CON_LYCONN_313102S141346]
CN13  Header 2x1  [CON_LYCONN_313102S141346]
CN14  Header 2x1  [CON_LYCONN_313102S141346]
CN15  Header 2x1  [CON_LYCONN_313102S141346]
R1  value 1K  [R0402]  (hidden comment: Resistor)
R2  value 47R  [R0402]  (hidden comment: Resistor)
R3  value 47R  [R0402]  (hidden comment: Resistor)
R4  value 47R  [R0402]  (hidden comment: Resistor)
R5  value 47R  [R0402]  (hidden comment: Resistor)
R6  value 10K  [R0402]  (hidden comment: Resistor)
R7  value 100K  [R0402]  (hidden comment: Resistor)
R24  value 4K7  [R0603]  (hidden comment: Resistor)
R44  value 4K7  [R0603]  (hidden comment: Resistor)
R52  value 10K  [R0402]  (hidden comment: Resistor)
R53  value 10K  [R0402]  (hidden comment: Resistor)
R54  value 10K  [R0402]  (hidden comment: Resistor)
U2  TMUX136  [ICC_UQFN10_RSE_R-PUQFN-N10_1P5X2_P050]
U3  value ESDA7P60-1U1M  [ESD_QFN2_1P6X1_P125]  (hidden comment: ESD-TRANSIL)
U14  ECMF02-2AMX6  [ESD_QFN-6L_1P7X1P5_P050]

### Blocks framed on the sheet
I2C1 Pull-up: R24 R44
USB User: C2 CN6 R7 U3 U14
LPUART switch: C1 R6 R52 R53 U2

### Ports
ARD (harness ARD), ARD.D11_SPI1_MOSI_TIM, ARD_ADC (harness ARD_ADC), BOOT0, COM (harness COM), GPIO_SELECT1, LPUART1_RX_MCU, LPUART1_TX_MCU, NRST, SAI1_CK2 (out), SAI1_DI2 (bidir), STMOD+ (harness STMOD+), USB_N, USB_P

### Harnesses
ARD_ADC: ADC1_IN4, ADC1_IN7, ADC1_IN13, ADC1_IN14
ARD: D0_RX, D1_TX, D2_IO, D3_TIM, D4_IO, D5_TIM, D6_TIM, D7, D8, D9_TIM, D10_SPI1_NSS_TIM, D12_SPI1_MISO, D13_SPI1_SCK
STMOD+: SPI2_NSS, LPUART1_CTS, SPI2_MOSI, LPUART1_TX, SPI2_MISO, SPI2_SCK, LPUART1_RX, LPUART1_RTS, SPI2_MOSI2, SPI2_MISO2, INT, RST, ADC1_IN5, TIM2_CH1, GPIO1, GPIO2
COM: I2C1_SCL, I2C1_SDA, ADC1_IN10, ADC1_IN2

### Nets
3V3: C1.2 CN2.2 CN2.4 R24.2 R44.2 U2.10(VCC)
5V: CN2.5 CN5.6 CN5.15
5V_INT: R1.2
5V_USB_MCU: C2.1 CN6.1(VBUS) U3.1(IO1)
AVDD: CN1.8
GND: C1.1 C2.2 CN1.7 CN2.6 CN2.7 CN5.5 CN5.16 CN6.5(GND) CN6.6(Shield) CN6.7(Shield) CN6.8(Shield) CN6.9(Shield) CN6.10(EXP) CN6.11(EXP) CN12.2 CN14.2 CN15.2 R6.2 R7.1 R52.1 R53.1 R54.1 U2.5(GND) U2.6(~{EN}) U3.2(GND) U14.3(GND)
VDD: CN13.2
VIN: CN2.8
ARD.D0_RX: CN4.1 U2.4(B2) ; port ARD.D0_RX
ARD.D1_TX: CN4.2 R53.2 U2.3(B1) ; port ARD.D1_TX
ARD.D2_IO: CN4.3 ; port ARD.D2_IO
ARD.D3_TIM: CN4.4 ; port ARD.D3_TIM
ARD.D4_IO: CN4.5 ; port ARD.D4_IO
ARD.D5_TIM: CN4.6 ; port ARD.D5_TIM
ARD.D6_TIM: CN4.7 ; port ARD.D6_TIM
ARD.D7: CN4.8 ; port ARD.D7
ARD.D8: CN1.1 ; port ARD.D8
ARD.D9_TIM: CN1.2 ; port ARD.D9_TIM
ARD.D10_SPI1_NSS_TIM: CN1.3 ; port ARD.D10_SPI1_NSS_TIM
ARD.D11_SPI1_MOSI_TIM: CN1.4 ; port ARD.D11_SPI1_MOSI_TIM
ARD.D12_SPI1_MISO: CN1.5 ; port ARD.D12_SPI1_MISO
ARD.D13_SPI1_SCK: CN1.6 ; port ARD.D13_SPI1_SCK
ARD_ADC.ADC1_IN4: CN3.1 ; port ARD_ADC.ADC1_IN4
ARD_ADC.ADC1_IN7: CN3.2 ; port ARD_ADC.ADC1_IN7
ARD_ADC.ADC1_IN13: CN3.5 ; port ARD_ADC.ADC1_IN13
ARD_ADC.ADC1_IN14: CN3.6 ; port ARD_ADC.ADC1_IN14
BOOT0: CN13.1 R54.2 ; port BOOT0
COM.ADC1_IN2: CN3.4 CN5.20 ; port COM.ADC1_IN2
COM.ADC1_IN10: CN3.3 CN5.19 CN15.1 ; port COM.ADC1_IN10
COM.I2C1_SCL: CN1.10 CN5.7 R24.1 ; port COM.I2C1_SCL
COM.I2C1_SDA: CN1.9 CN5.10 R44.1 ; port COM.I2C1_SDA
GPIO_SELECT1: R6.1 U2.9(SEL) ; port GPIO_SELECT1
LPUART1_RX_MCU: U2.7(COM2) ; port LPUART1_RX_MCU
LPUART1_TX_MCU: U2.8(COM1) ; port LPUART1_TX_MCU
NRST: CN2.3 ; port NRST
SAI1_CK2: CN12.1 ; port SAI1_CK2
SAI1_DI2: CN14.1 ; port SAI1_DI2
STMOD+.ADC1_IN5: CN5.13 ; port STMOD+.ADC1_IN5
STMOD+.GPIO1: CN5.17 ; port STMOD+.GPIO1
STMOD+.GPIO2: CN5.18 ; port STMOD+.GPIO2
STMOD+.INT: CN5.11 ; port STMOD+.INT
STMOD+.LPUART1_CTS: R2.1 ; port STMOD+.LPUART1_CTS
STMOD+.LPUART1_RTS: R5.1 ; port STMOD+.LPUART1_RTS
STMOD+.LPUART1_RX: R4.1 U2.2(A2) ; port STMOD+.LPUART1_RX
STMOD+.LPUART1_TX: R3.1 R52.2 U2.1(A1) ; port STMOD+.LPUART1_TX
STMOD+.RST: CN5.12 ; port STMOD+.RST
STMOD+.SPI2_MISO: CN5.3 R4.2 ; port STMOD+.SPI2_MISO
STMOD+.SPI2_MISO2: CN5.9 ; port STMOD+.SPI2_MISO2
STMOD+.SPI2_MOSI: CN5.2 R3.2 ; port STMOD+.SPI2_MOSI
STMOD+.SPI2_MOSI2: CN5.8 ; port STMOD+.SPI2_MOSI2
STMOD+.SPI2_NSS: CN5.1 R2.2 ; port STMOD+.SPI2_NSS
STMOD+.SPI2_SCK: CN5.4 R5.2 ; port STMOD+.SPI2_SCK
STMOD+.TIM2_CH1: CN5.14 ; port STMOD+.TIM2_CH1
USB_N: U14.2(D-) ; port USB_N
USB_P: U14.1(D+) ; port USB_P
NetCN2_1: CN2.1 R1.1
NetCN6_2: CN6.2(DM) U14.5(D-)
NetCN6_3: CN6.3(DP) U14.6(D+)
NetCN6_4: CN6.4(ID) R7.2

Not connected (* = marked no-connect by the designer): U14 4(NC)*

### Layout directives
differential pair: USB_N, USB_P

### Notes on the sheet
- Arduino connectors
- PC3
- (near CN1) SDA/D14
- (near CN1) SCL/D15
- (near CN1) AVDD
- (near CN1) PB8
- (near CN1) PA10
- PC4
- PA2
- PC5
- IOREF
- NRST
- 3V3
- 5V
- (near CN2) GND
- (near CN2) IOREF
- (near CN2) NRST
- (near CN2) 3V3
- (near CN2) 5V
- (near CN1) PWM/CS/D10
- (near CN1) SCK/D13
- (near CN1) MISO/D12
- (near CN1) PWM/MOSI/D11
- (near CN1) GND
- (near CN1) PA1
- (near CN1) PB4
- (near CN1) PA7
- (near CN1) PA4
- WARNING voltage applied to VIN <11.5V
- (near CN2) VIN
- POWER
- (near CN1) D8
- (near CN1) PWM/D9
- (near CN1) PD15
- (near CN1) PD13
- (near CN3) PC3
- (near CN3) PA2
- (near CN3) PA5
- (near CN3) PC1
- (near CN3) A0
- (near CN3) A1
- (near CN3) A2
- AIN
- (near CN4) PWM/D5
- (near CN4) PWM/D6
- (near CN4) D7
- (near CN4) PB2
- (near CN4) PE0
- (near CN4) PB10
- (near CN4) PE4
- (near CN3) PC4
- (near CN3) PC5
- (near CN3) A3
- (near CN3) A4
- (near CN3) A5
- (near CN4) RX/D0
- (near CN4) TX/D1
- (near CN4) D2
- (near CN4) D4
- (near CN4) PWM/D3
- (near CN4) PD14
- (near CN4) PD12
- (near CN4) PB5
- (near CN4) PC0
- STMOD+
- (near R2) PD0
- Common signals
- (near R2) PA6
- PD4
- PB5
- PC2
- PC0
- PD1
- PE3
- PD8
- PA0
- PA15
- (near R5) PB12
- (near R5) PB8
- PC11
- PA5
- PC10
- PC1
- (near R5) PB15
- PB14
- PA10
- (near CN12) PA8
- (near CN14) PA9
- MCO
- MCO_IN
- (near CN15) Loopback
- Connectors reserved
- Title:
- Project:
- Size:
- Revision:
- Variant:
- -
- Date:
- Reference:
- Sheet:
- of
- (in symbol MCD-00028) USB_Micro-B receptacle
- (in symbol MCD-02116) STMod+

### Library data of the parts
C1 = MCD-02119: Capacitor, MLCC, 100nF, 6V3, X5R, 10%, 0603, T=0,8mm; Part_Preference: Recommended; Manufacturer: KEMET; Manufacturer_Part_Number: C0603C104K9PACTU; Internal_Part_Number: MCD-02119; Status: Checked; Part_Type: Capacitor; Alternate_Manufacturer: N/A; Alternate_Manufacturer_Part_Number: N/A; Package: C0603; ComponentLink1URL: http://tunmcdsvn.tun.st.com/Component_Datasheet_Library/Trunk/Capacitors/KEMET_Capacitor_X5R-series/KEMET_Capacitor_C0603C104K9PACTU; Order_Code_Digikey: N/A; Order_Code_Farnell: 2941311; Order_Code_RS: N/A
C2 = MCD-01648: as C41 on sheet ST-LINK_V2-1; Internal_Part_Number: MCD-01648; Status: Released; Part_Type: Capacitor; Package: C0603; ComponentLink1URL: http://tunmcdsvn.tun.st.com/Component_Datasheet_Library/Trunk/Capacitors/Yageo_UPY-GP_NP0_16V-to-50V/YAGEO_NP0_UPY-GP_NP0_16V-to-50V_16.pdf; Order_Code_Digikey: 311-1069-1-ND; Order_Code_Farnell: 722080
CN1 = MCD-00301: Socket, 10x1, 2.54mm, VR, SMT, Height 9.78mm; Part_Type: Connector; Manufacturer_Part_Number: SSW-110-22-L-S-VS; Manufacturer: SAMTEC; Part_Preference: Recommended; Internal_Part_Number: MCD-00301; Value: Socket 10x1; Status: Checked; ComponentLink1URL: http://tunmcdsvn.tun.st.com/Component_Datasheet_Library/Trunk/Connectors/Samtec_SSW_smt_series
CN2 CN4 = MCD-00300: Socket, 8x1, 2.54mm, VR, SMT, Height 9.78mm; Part_Type: Connector; Manufacturer_Part_Number: SSW-108-22-L-S-VS; Manufacturer: SAMTEC; Part_Preference: Recommended; Internal_Part_Number: MCD-00300; Value: Socket 8x1; Status: Checked; ComponentLink1URL: http://tunmcdsvn.tun.st.com/Component_Datasheet_Library/Trunk/Connectors/Samtec_SSW_smt_series
CN3 = MCD-00299: Socket, 6x1, 2.54mm, VR, SMT, Height 9.78mm; Part_Type: Connector; Manufacturer_Part_Number: SSW-106-22-L-S-VS; Manufacturer: SAMTEC; Part_Preference: Recommended; Internal_Part_Number: MCD-00299; Value: Socket 6x1; Status: Checked; ComponentLink1URL: http://tunmcdsvn.tun.st.com/Component_Datasheet_Library/Trunk/Connectors/Samtec_SSW_smt_series
CN5 = MCD-02116: Socket, 10x2, 2mm, Straight,SMT, height 9.2mm; Part_Type: Connector; Manufacturer_Part_Number: DF11-20DS-2DSA(06); Manufacturer: HIROSE; Part_Preference: Recommended; Order_Code_RS: 688-8900; Internal_Part_Number: MCD-02116; Status: Checked; Alternate_Manufacturer_Part_Number: N/A; Alternate_Manufacturer: N/A; Package: DIP socket; ComponentLink1URL: http://tunmcdsvn.tun.st.com/Component_Datasheet_Library/Trunk/Connectors/Hirose_Connector_DF11-series_DF11-20DS-2DSA; Order_Code_Digikey: H10190-ND; Order_Code_Farnell: 2724913
CN6 = MCD-00028: as CN11 on sheet ST-LINK_V2-1; Internal_Part_Number: MCD-00028; Status: Released; ComponentLink1URL: http://tunmcdsvn.tun.st.com/Component_Datasheet_Library/Trunk/Connectors/Molex_Connector-USB-microB_105017-0001
CN12-CN15 = MCD-01668: Header 2x1, 2.54mm, VR, TH, height 5.84mm/5.08 mm, height total 13.46 mm; Part_Type: Connector; Manufacturer_Part_Number: 313102S141346; Manufacturer: LYCONN; Part_Preference: Recommended; Internal_Part_Number: MCD-01668; Value: Header 2x1; Status: Released; ComponentLink1URL: http://tunmcdsvn.tun.st.com/Component_Datasheet_Library/Trunk/Connectors/LYCONN_31XXX_2.54mm_L13.46mm/LYCONN_31XXX_2.54mm_L13.46mm.pdf
R1 = MCD-00061: Resistor,1K,0402,1%,1/16W; Manufacturer_Part_Number: RC0402FR-071KL; Manufacturer: YAGEO; Part_Preference: Recommended; Internal_Part_Number: MCD-00061; Status: Released; Part_Type: Resistor; Package: R0402; ComponentLink1URL: http://tunmcdsvn.tun.st.com/Component_Datasheet_Library/Trunk/Resistors/Yageo_Resistor_RC0402-series; Order_Code_Digikey: 311-1.00KLRCT-ND; Order_Code_Farnell: 9239235; Order_Code_RS: N/A
R2-R5 = MCD-00481: Resistor,47R,0402,1%,1/16W; Manufacturer_Part_Number: RC0402FR-0747RL; Manufacturer: YAGEO; Part_Preference: Recommended; Internal_Part_Number: MCD-00481; Status: Released; Part_Type: Resistor; Package: R0402; ComponentLink1URL: http://tunmcdsvn.tun.st.com/Component_Datasheet_Library/Trunk/Resistors/Yageo_Resistor_RC0402-series; Order_Code_Digikey: 311-47.0LRCT-ND; Order_Code_Farnell: 9239073; Order_Code_RS: N/A
R6 R52-R54 = MCD-00053: as R21 on sheet ST-LINK_V2-1; Internal_Part_Number: MCD-00053; Status: Released; Part_Type: Resistor; Package: R0402; ComponentLink1URL: http://tunmcdsvn.tun.st.com/Component_Datasheet_Library/Trunk/Resistors/Yageo_Resistor_RC0402-series; Order_Code_Digikey: 311-10.0KLRCT-ND; Order_Code_Farnell: 9239359; Order_Code_RS: N/A
R7 = MCD-00059: as R19 on sheet ST-LINK_V2-1; Internal_Part_Number: MCD-00059; Alternate_Manufacturer: YAGEO; Status: Released; Part_Type: Resistor; ComponentLink1URL: http://tunmcdsvn.tun.st.com/Component_Datasheet_Library/Trunk/Resistors/Yageo_Resistor_RC0402-series; Package: R0402; Order_Code_Digikey: 311-100KLRTR-ND; Order_Code_Farnell: 2421891; Order_Code_RS: N/A
R24 R44 = MCD-00219: Resistor,4K7,0603,1%,1/10W; Manufacturer_Part_Number: RC0603FR-074K7L; Manufacturer: YAGEO; Part_Preference: Recommended; Internal_Part_Number: MCD-00219; Status: Released; Part_Type: Resistor; Package: R0603; ComponentLink1URL: http://tunmcdsvn.tun.st.com/Component_Datasheet_Library/Trunk/Resistors/Yageo_Resistor_RC0603-series; Order_Code_Digikey: 311-4.70KHRCT-ND; Order_Code_Farnell: 9238565; Order_Code_RS: N/A
U2 = MCD-01847: 6-GHz, 2-Channel, 2:1 Switch, With Power-off Isolation; Part_Type: IC; Manufacturer: TEXAS INSTRUMENTS; Part_Preference: Recommended; Internal_Part_Number: MCD-01847; Status: Checked; Manufacturer_Part_Number: TMUX136; ComponentLink1URL: http://tunmcdsvn.tun.st.com/Component_Datasheet_Library/Trunk/IC/TI_2-channel_switch_TMUX136; Value: TMUX136; Package: UQFN-10; Order_Code_Digikey: 296-47396-1-ND; Order_Code_Farnell: 2802932RL; Order_Code_RS: N/A
U3 = MCD-00251: as U16 on sheet ST-LINK_V2-1; Internal_Part_Number: MCD-00251; Status: Released; Manufacturer_Part_Number: ESDA7P60-1U1M; ComponentLink1URL: http://tunmcdsvn.tun.st.com/Component_Datasheet_Library/Trunk/Diodes/STM_ESD_ESDA7P60-1U1M
U14 = MCD-00649: as U17 on sheet ST-LINK_V2-1; Internal_Part_Number: MCD-00649; Value: ECMF02-2AMX6; Status: Released; Manufacturer_Part_Number: ECMF02-2AMX6; ComponentLink1URL: http://tunmcdsvn.tun.st.com/Component_Datasheet_Library/Trunk/Diodes/STM_ESD_ECMF02-2AMX6